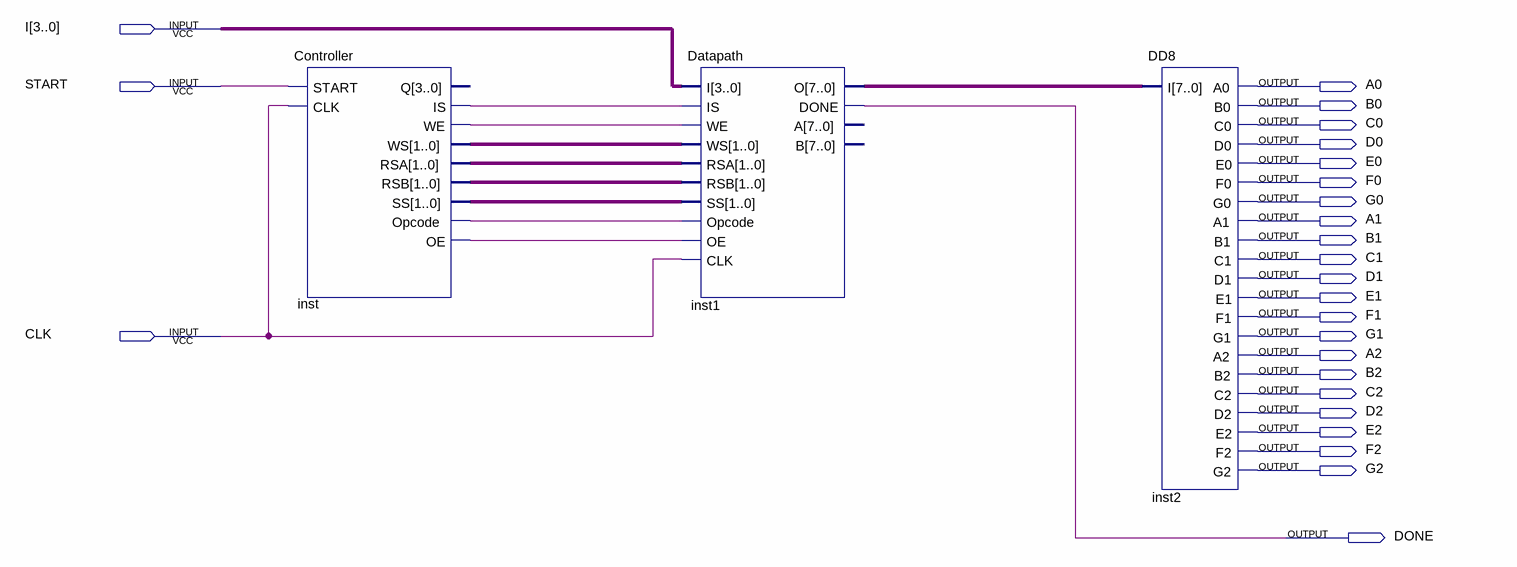
[diagram p0: schematic sheet]
// Quartus schematic Mulw4ln.bdf as structural Verilog: 3 symbols, 25 pins
module Mulw4ln (
  input  [3:0] I,
  input  START,
  input  CLK,
  output A0,
  output B0,
  output C0,
  output D0,
  output E0,
  output F0,
  output G0,
  output A1,
  output B1,
  output C1,
  output D1,
  output E1,
  output F1,
  output G1,
  output A2,
  output B2,
  output C2,
  output D2,
  output E2,
  output F2,
  output G2,
  output DONE
);

  wire inst_is, inst_oe, inst_opcode, inst_we;
  wire [1:0] inst_rsa, inst_rsb, inst_ss, inst_ws;
  wire [7:0] inst1_o;

  Controller inst (
    .START(START), .CLK(CLK), .IS(inst_is), .WE(inst_we), .WS(inst_ws), .RSA(inst_rsa), .RSB(inst_rsb),
    .SS(inst_ss), .Opcode(inst_opcode), .OE(inst_oe));  // open: Q
  Datapath inst1 (
    .I(I), .IS(inst_is), .WE(inst_we), .WS(inst_ws), .RSA(inst_rsa), .RSB(inst_rsb), .SS(inst_ss),
    .Opcode(inst_opcode), .OE(inst_oe), .CLK(CLK), .O(inst1_o), .DONE(DONE));  // open: A, B
  DD8 inst2 (
    .I(inst1_o), .A0(A0), .B0(B0), .C0(C0), .D0(D0), .E0(E0), .F0(F0), .G0(G0), .A1(A1), .B1(B1), .C1(C1),
    .D1(D1), .E1(E1), .F1(F1), .G1(G1), .A2(A2), .B2(B2), .C2(C2), .D2(D2), .E2(E2), .F2(F2), .G2(G2));
endmodule
